# EAGLE design 1DPong_FootController (EAGLE 6.5.0)
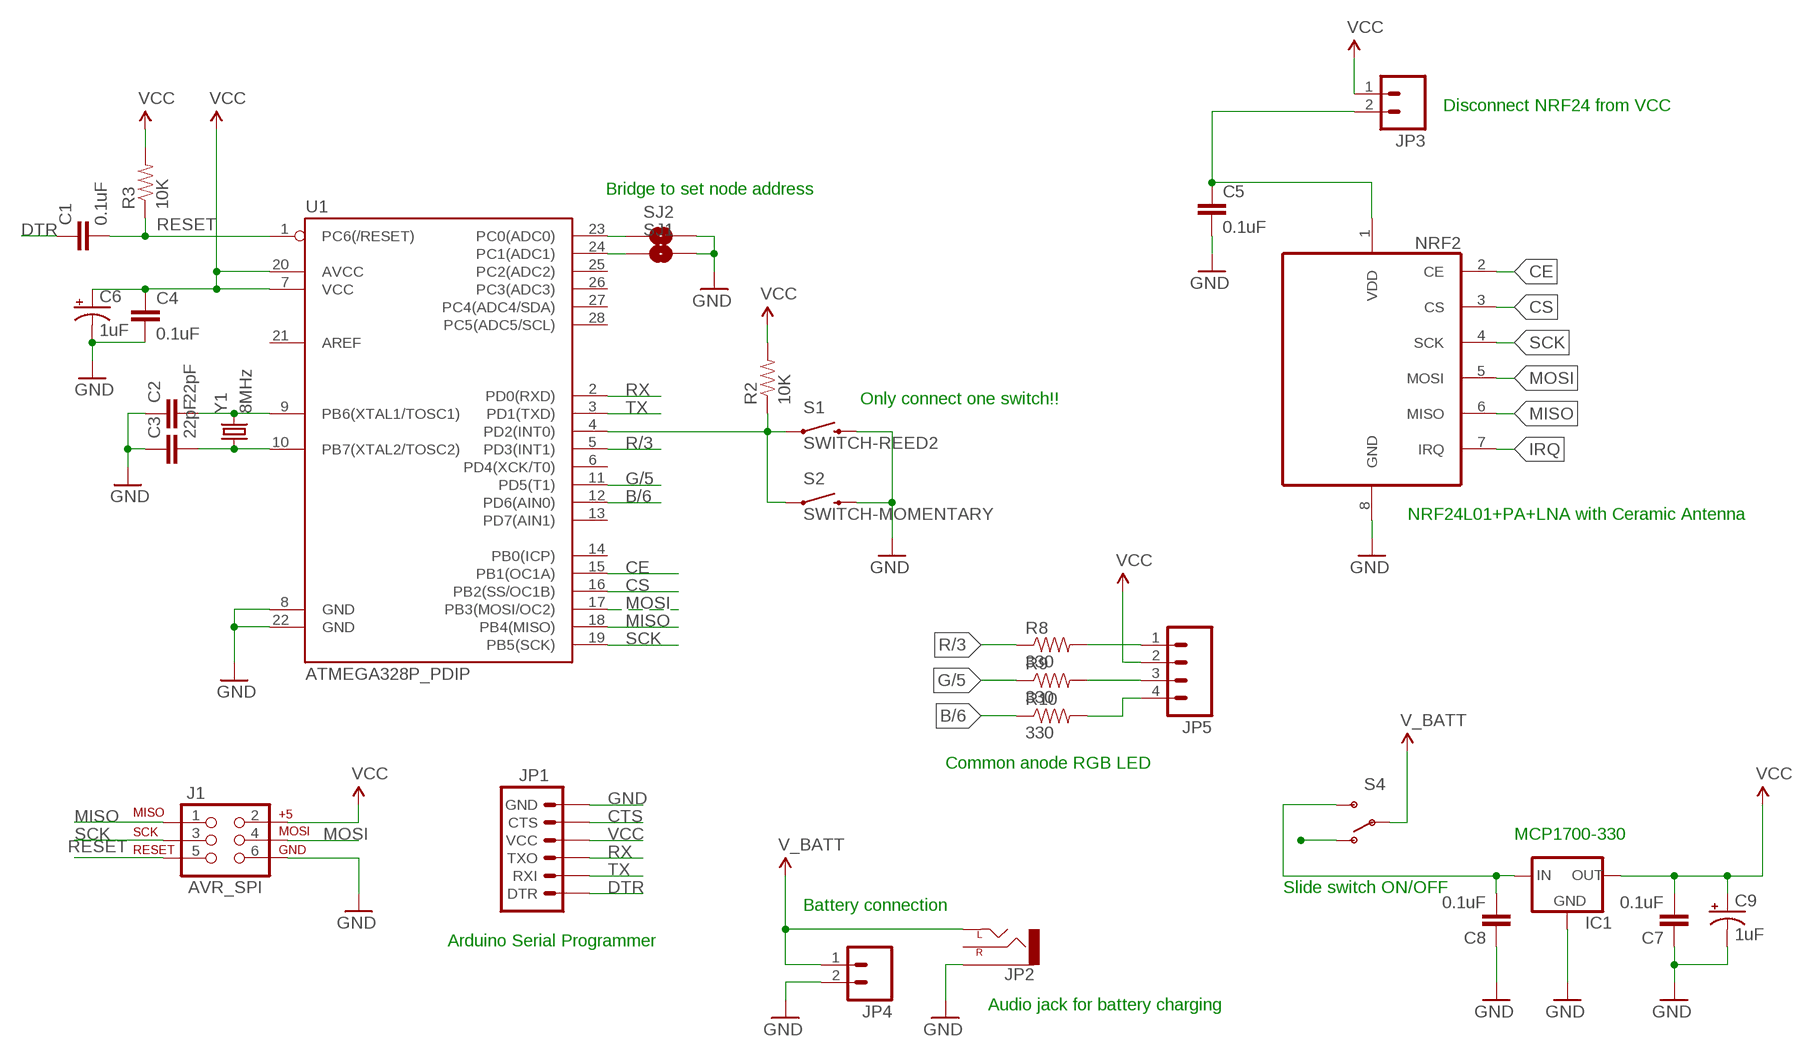
[diagram p0: schematic, sheet 1]

## Parts
C1  0.1uF  CAPPTH  [CAP-PTH-SMALL]
C2  22pF  CAPPTH  [CAP-PTH-SMALL]
C3  22pF  CAPPTH  [CAP-PTH-SMALL]
C4  0.1uF  CAPPTH  [CAP-PTH-SMALL]
C5  0.1uF  CAPPTH  [CAP-PTH-SMALL]
C6  1uF  CAP_POLPTH2  [CPOL-RADIAL-10UF-25V]
C7  0.1uF  CAPPTH  [CAP-PTH-SMALL]
C8  0.1uF  CAPPTH  [CAP-PTH-SMALL]
C9  1uF  CAP_POLPTH2  [CPOL-RADIAL-10UF-25V]
IC1  V_REG_78XXTO-92_UNTESTED  [TO-92]
J1  AVR_SPI  AVR_SPI_PRG_6PTH  [2X3]
JP1  ARDUINO_SERIAL_PROGRAMPTH  [1X06]
JP2  AUDIO-JACKPTH  [AUDIO-JACK]
JP3  M02PTH  [1X02]
JP4  M02PTH  [1X02]
JP5  M04PTH  [1X04]
NRF2  NRF24L01_SOIC  [NRF24L01_SOIC]
R2  10K  RESISTOR1206  [1206]
R3  10K  RESISTOR1206  [1206]
R8  330  RESISTOR1206  [1206]
R9  330  RESISTOR1206  [1206]
R10  330  RESISTOR1206  [1206]
S1  SWITCH-REED2  SWITCH-MOMENTARY-2PTH_REED2  [REED_SWITCH_PLASTIC]
S2  SWITCH-MOMENTARY  SWITCH-MOMENTARY-2PTH  [TACTILE-PTH]
S4  SWITCH-SPDT-SMD-A  [SWITCH-SPST-SMD-A]
SJ1  JUMPER-PAD-2-NOYES_SILK  [PAD-JUMPER-2-NO_YES_SILK]
SJ2  JUMPER-PAD-2-NOYES_SILK  [PAD-JUMPER-2-NO_YES_SILK]
U1  ATMEGA328P_PDIP  [DIL28-3]
Y1  8MHz  CRYSTALHC49US  [HC49US]

## Nets
B/6: R10.1 U1.12(PD6(AIN0))
CE: NRF2.2(CE) U1.15(PB1(OC1A))
CS: NRF2.3(CS) U1.16(PB2(SS/OC1B))
CTS: JP1.CTS
DTR: C1.1 JP1.DTR
G/5: R9.1 U1.11(PD5(T1))
GND: C2.1 C3.1 C4.2 C5.2 C6.2(-) C7.1 C8.1 C9.2(-) IC1.1(GND) J1.6 JP1.GND JP2.SLEEVE JP4.2 NRF2.8(GND) S1.P$2 S2.3 SJ1.2 SJ2.2 U1.8(GND) U1.22(GND)
IRQ: NRF2.7(IRQ)
MISO: J1.1 NRF2.6(MISO) U1.18(PB4(MISO))
MOSI: J1.4 NRF2.5(MOSI) U1.17(PB3(MOSI/OC2))
N$1: C2.2 U1.9(PB6(XTAL1/TOSC1)) Y1.2
N$2: C3.2 U1.10(PB7(XTAL2/TOSC2)) Y1.1
N$3: JP5.1 R8.2
N$5: SJ2.1 U1.23(PC0(ADC0))
N$6: SJ1.1 U1.24(PC1(ADC1))
N$7: JP5.3 R9.2
N$8: R2.1 S1.P$1 S2.1 U1.4(PD2(INT0))
N$10: C5.1 JP3.2 NRF2.1(VDD)
N$11: JP5.4 R10.2
N$12: S4.1(O)
N$16: C8.2 IC1.2(IN) S4.3(S)
R/3: R8.1 U1.5(PD3(INT1))
RESET: C1.2 J1.5 R3.1 U1.1(PC6(/RESET))
RX: JP1.TXO U1.2(PD0(RXD))
SCK: J1.3 NRF2.4(SCK) U1.19(PB5(SCK))
TX: JP1.RXI U1.3(PD1(TXD))
V_BATT: JP2.TIP(LEFT) JP4.1 S4.2(P)
VCC: C4.1 C6.1(+) C7.2 C9.1(+) IC1.3(OUT) J1.2 JP1.VCC JP3.1 JP5.2 R2.2 R3.2 U1.7(VCC) U1.20(AVCC)
Unconnected: JP2.RING(RIGHT) U1.6(PD4(XCK/T0)) U1.13(PD7(AIN1)) U1.14(PB0(ICP)) U1.21(AREF) U1.25(PC2(ADC2)) U1.26(PC3(ADC3)) U1.27(PC4(ADC4/SDA)) U1.28(PC5(ADC5/SCL))

## Notes on the sheet
- Disconnect NRF24 from VCC
- Bridge to set node address
- Only connect one switch!!
- NRF24L01+PA+LNA with Ceramic Antenna
- Common anode RGB LED
- MCP1700-330
- Slide switch ON/OFF
- Battery connection
- Arduino Serial Programmer
- Audio jack for battery charging

## Library data of the parts
C1-C5 C7 C8 = SparkFun-Capacitors:CAP: Capacitor Standard 0603 ceramic capacitor, and 0.1" leaded capacitor.
C6 C9 = SparkFun-Passives:CAP_POL: Capacitor Polarized These are standard SMD and PTH capacitors. Normally 10uF, 47uF, and 100uF in electrolytic and tantalum varieties. Always verify the external diameter of the through hole cap, it varies with capacity, voltage, and manufacturer. The EIA devices should be standard.
IC1 = SparkFun-PowerIC:V_REG_78XX: Voltage Regulator Standard 7805 5V regulator. IGO (Input Ground Output). Spark Fun Electronics SKU : COM-00107
J1 = SparkFun-Connectors:AVR_SPI_PRG_6: AVR ISP 6 Pin This is the reduced ISP connector for AVR programming. Common on Arduino. This footprint will take up less PCB space and can be used with a 10-pin to 6-pin adapter such as SKU: BOB-08508 **Special note about "TEST_POINT" package. The stop mask is on the top side, so if you want your programming test points to be on the bottom of your board, make sure to place this package on the bottom side of the board. This also ensure that the orientation to program from the bottom side will be correct.
JP1 = SparkFun-Connectors:ARDUINO_SERIAL_PROGRAM: FTDI connector footprints
JP2 = SparkFun-Connectors:AUDIO-JACK: 3.5mm Audio Jack Simple 3.5mm common PCB mount audio jack. SKU: PRT-08032
JP3 JP4 = SparkFun-Connectors:M02: Standard 2-pin 0.1" header. Use with - straight break away headers ( PRT-00116) - right angle break away headers (PRT-00553) - swiss pins (PRT-00743) - machine pins (PRT-00117) - female headers (PRT-00115) Molex polarized connector foot print use with: PRT-08233 with associated crimp pins and housings. 2.54_SCREWTERM for use with PRT-10571. 3.5mm Screw Terminal footprints for PRT-08084 5mm Screw Terminal footprints for use with PRT-08432
JP5 = SparkFun-Connectors:M04: Header 4 Standard 4-pin 0.1" header. Use with straight break away headers (SKU : PRT-00116), right angle break away headers (PRT-00553), swiss pins (PRT-00743), machine pins (PRT-00117), and female headers (PRT-00115). Molex polarized connector foot print use with SKU : PRT-08231 with associated crimp pins and housings. 1MM SMD Version SKU: PRT-10208
NRF2 = NRF24L01:NRF24L01_SOIC
R2 R3 R8-R10 = SparkFun-Resistors:RESISTOR: Resistor Basic schematic elements and footprints for 0603, 1206, and PTH resistors.
S1 S2 = SparkFun-Electromechanical:SWITCH-MOMENTARY-2: Various NO switches- pushbuttons, reed, etc
S4 = SparkFun-Electromechanical:SWITCH-SPDT: SPDT Switch Simple slide switch, Spark Fun Electronics SKU : COM-00102 DPDT SMT slide switch, AYZ0202, SWCH-08179
SJ1 SJ2 = SparkFun-Passives:JUMPER-PAD-2-NO
U1 = SparkFun-DigitalIC:ATMEGA328P_PDIP: uC used in the Arduino 32kb flash, 1k EEPROM, 2k SRAM This is the through-hole version of this chip.
Y1 = SparkFun-FreqCtrl:CRYSTAL: Various standard crystals. Proven footprints. Spark Fun Electronics SKU : COM-00534

## Board
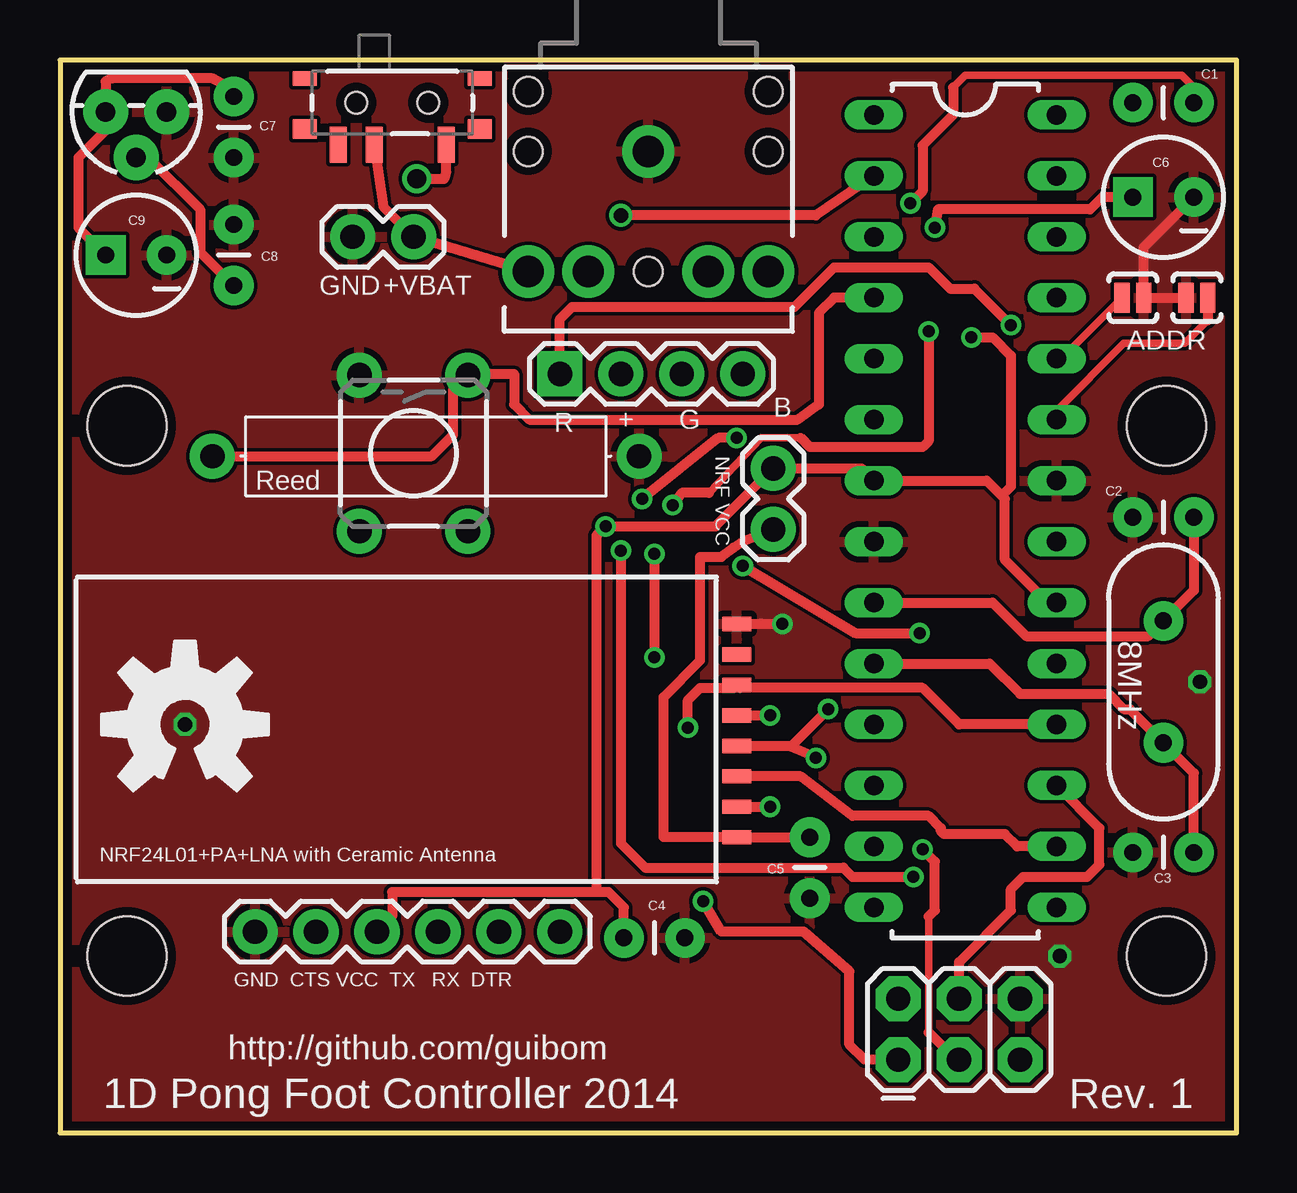
[diagram p1: board, top side]
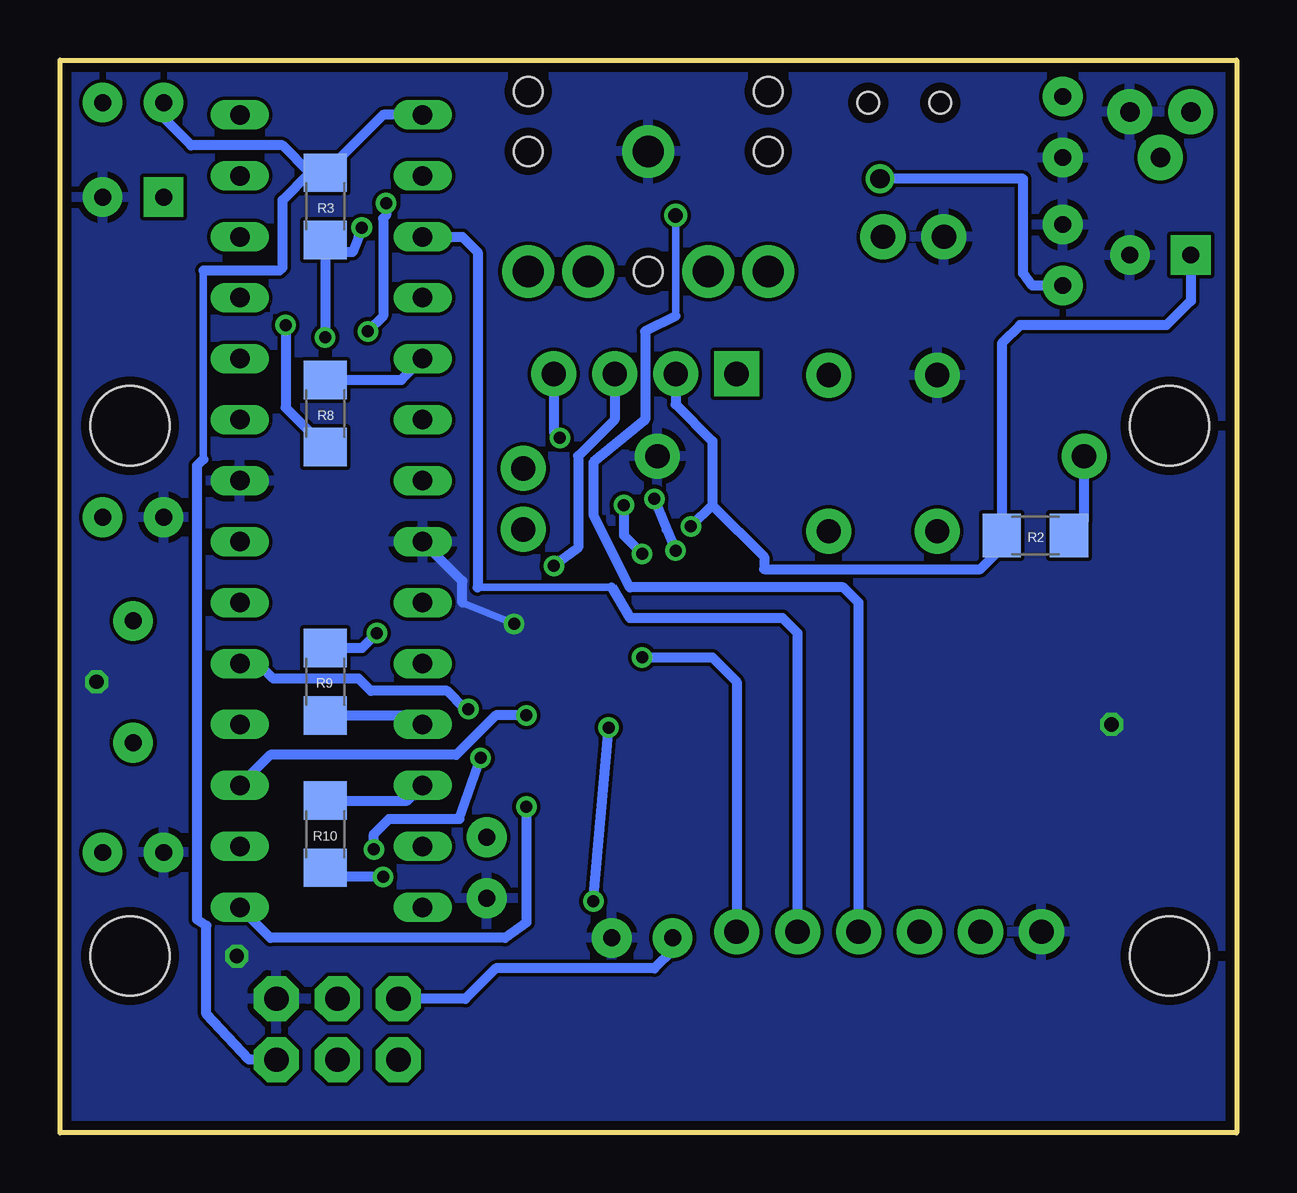
[diagram p2: board, bottom side, seen from below]

Size 49.02 x 44.7 mm. Coordinates in mm from the lower left corner, seen from the top.
Outline: 0,44.7 0,0 49.02,0 49.02,44.7 0,44.7
Copper layers (1*16): Top 0.0356mm / dielectric 1.5011mm / Bottom 0.0356mm
Design rules "LaenPCBOrder *": minimum track width 6mil, minimum drill 13mil, track to track 6mil, track to pad 6mil, pad to pad 6mil, via to via 6mil, smd to smd 6mil, copper to edge 15mil, drill to drill 6mil, minimum pad ring 7mil, minimum via ring 7mil, stop-mask expansion 3mil, vias tented up to drill 24mil, thermal gap 10mil

### Footprints (pad centres in the part's own frame; a part is rotated, then mirrored left to right if it is on the bottom)
CAP-PTH-SMALL = drill 0.7 pad 1.651: 1 0,0; 2 2.54,0
CPOL-RADIAL-10UF-25V = drill 0.7 pad 1.651 square: 1 1.27,0 | drill 0.7 pad 1.651: 2 -1.27,0
TO-92 = drill 0.813 pad 1.88: 1 -1.27,0; 2 0,1.905; 3 1.27,0
2X3 = drill 1.016 pad 1.88 octagon: 1 0,0; 2 0,2.54; 3 2.54,0; 4 2.54,2.54; 5 5.08,0; 6 5.08,2.54
1X06 = drill 1.016 pad 1.88: CTS 10.16,0; DTR 0,0; GND 12.7,0; RXI 2.54,0; TXO 5.08,0; VCC 7.62,0
AUDIO-JACK = drill 1.3 pad 2.184: RING 5,5; RSH 5,2.5; SLEEVE 0,0; TIP 5,-5; TSH 5,-2.5 | hole 1.2: 0,5; -2.5,5; -2.5,-5; 0,-5; 5,0
1X02 = drill 1.016 pad 1.88: 1 0,0; 2 2.54,0
1X04 = drill 1.016 pad 1.88 square: 1 0,0 | drill 1.016 pad 1.88: 2 2.54,0; 3 5.08,0; 4 7.62,0
NRF24L01_SOIC = smd 0.6 x 1.2: 1 -4.445,-2.8; 2 -3.175,-2.8; 3 -1.905,-2.8; 4 -0.635,-2.8; 5 0.635,-2.8; 6 1.905,-2.8; 7 3.175,-2.8; 8 4.445,-2.8
1206 = smd 1.6 x 1.8: 1 -1.4,0; 2 1.4,0
REED_SWITCH_PLASTIC = drill 1.016 pad 1.88: P$1 -8.89,0; P$2 8.89,0
TACTILE-PTH = drill 1.016 pad 1.88: 1 -3.251,2.261; 2 3.251,2.261; 3 -3.251,-2.261; 4 3.251,-2.261
SWITCH-SPST-SMD-A = smd 0.7 x 1.5: 1 -2.25,-1.75; 2 -0.75,-1.75; 3 2.25,-1.75 | smd 1 x 0.6: GND1 -3.65,1; GND3 3.65,1 | smd 1 x 0.8: GND2 -3.65,-1.1; GND4 3.65,-1.1 | hole 0.9: -1.5,0; 1.5,0
PAD-JUMPER-2-NO_YES_SILK = smd 0.635 x 1.27: 1 -0.45,0; 2 0.45,0
DIL28-3 = drill 0.813 long: 1 -16.51,-3.81; 2 -13.97,-3.81; 3 -11.43,-3.81; 4 -8.89,-3.81; 5 -6.35,-3.81; 6 -3.81,-3.81; 7 -1.27,-3.81; 8 1.27,-3.81; 9 3.81,-3.81; 10 6.35,-3.81; 11 8.89,-3.81; 12 11.43,-3.81; 13 13.97,-3.81; 14 16.51,-3.81; 15 16.51,3.81; 16 13.97,3.81; 17 11.43,3.81; 18 8.89,3.81; 19 6.35,3.81; 20 3.81,3.81; 21 1.27,3.81; 22 -1.27,3.81; 23 -3.81,3.81; 24 -6.35,3.81; 25 -8.89,3.81; 26 -11.43,3.81; 27 -13.97,3.81; 28 -16.51,3.81
STAND-OFF = hole 3.302: 0,0
HC49US = drill 0.7 pad 1.651: 1 -2.54,0; 2 2.54,0

### Placement (x,y rotation side)
C1  47.24,42.93 180 top
C2  44.7,25.65 0 top
C3  44.7,11.68 0 top
C4  23.5,8.13 0 top
C5  31.24,12.32 270 top
C6  45.97,38.99 180 top
C7  7.24,40.64 90 top
C8  7.24,37.85 270 top
C9  3.17,36.58 180 top
IC1  3.17,42.54 180 top
J1  34.92,3.05 0 top
JP1  20.83,8.38 180 top
JP2  24.51,40.89 270 top
JP3  29.72,27.69 270 top
JP4  14.73,37.34 180 top
JP5  20.83,31.62 0 top
NRF2  25.4,16.76 90 top
R2  8.38,24.89 180 bottom
R3  37.97,38.61 270 bottom
R8  37.97,29.97 270 bottom
R9  37.97,18.8 90 bottom
R10  37.97,12.45 270 bottom
S1  15.24,28.19 0 top
S2  14.73,28.32 270 top
S4  13.84,42.93 0 top
SJ1  44.7,34.8 0 top
SJ2  47.37,34.8 180 top
U1  37.72,25.91 270 top
U$1  [STAND-OFF]  2.79,7.37 0 top
U$2  [STAND-OFF]  46.1,7.37 0 top
U$3  [STAND-OFF]  2.79,29.46 0 top
U$4  [STAND-OFF]  46.1,29.46 0 top
U$5  [OSHW-LOGO-L]  5.21,17.02 0 top
Y1  45.97,18.8 90 top

### Tracks (layer width: path | path; a pad name or v marks a point on that pad's centre or on a via)
B/6
  Bottom 0.406: R10.1 34.54,13.84 U1.12
CE  (via drill 0.5)
  Top 0.406: NRF2.2 v29.59,13.59
  Bottom 0.406: v29.59,13.59 29.59,8.76 30.48,8.13 40.26,8.13 U1.15
CS
  Top 0.406: U1.16 39.88,11.94 39.37,12.45 36.83,12.45 36.7,12.57 36.7,12.7 36.2,13.21 33.02,13.21 30.86,14.86 NRF2.3
DTR  (via drill 0.5)
  Top 0.305: 47.24,43.56 46.74,44.07 37.72,44.07 37.21,43.56 | 30.86,28.96 29.21,28.96 27.05,26.67
  Top 0.406: C1.1 47.24,43.56 | 37.21,43.56 37.21,42.42 35.94,41.15 35.94,39.24 v35.43,38.73 | v36.2,33.4 36.2,28.83 35.94,28.58 31.24,28.58 30.86,28.96 | 27.05,26.67 25.91,26.67 v25.53,26.16 | v24.77,24.13 v24.77,19.81
  Bottom 0.406: v35.43,38.73 35.43,38.23 35.56,38.1 35.56,34.04 v36.2,33.4 | v25.53,26.16 25.53,24.89 v24.77,24.13 | v24.77,19.81 21.84,19.81 20.83,18.8 JP1.DTR
G/5
  Bottom 0.406: R9.1 34.29,17.4 U1.11
GND  (via drill 0.5, 0.6)
  Top 0.406: SJ2.2 SJ1.2 45.15,36.9 C6.2 | NRF2.8 29.22,21.21 v30.1,21.21
  Bottom 0.305: v30.1,21.21 32.26,22.1
  Bottom 0.406: 32.26,22.1 32.26,22.99 U1.8
  other vias: 5.21,17.02 41.66,7.37 47.5,18.8
  pour Top: -1.4,45.59 -1.4,-1.4 50.67,-1.4 50.67,45.59
  pour Bottom: -1.4,45.59 -1.4,-1.4 50.67,-1.4 50.67,45.59
MISO  (via drill 0.5)
  Top 0.406: U1.18 37.46,17.02 35.94,18.54 28.33,18.54 NRF2.6 28.07,18.54 26.67,18.54 26.16,18.03 v26.16,16.89 | J1.1 33.53,3.05 32.89,3.68 32.89,6.73 30.99,8.38 27.56,8.38 v26.8,9.65
  Bottom 0.406: v26.8,9.65 v26.16,16.89
MOSI  (via drill 0.5)
  Top 0.406: NRF2.5 v29.59,17.4 | J1.4 37.46,7.11 39.62,9.27 39.62,10.16 40.13,10.67 42.8,10.67 43.31,11.18 43.31,12.7 U1.17
  Bottom 0.406: v29.59,17.4 30.86,17.4 32.51,15.75 40.26,15.75 U1.17
N$1
  Top 0.406: C2.2 47.24,22.61 Y1.2 45.34,20.7 40.26,20.7 38.86,22.1 U1.9
N$2
  Top 0.406: C3.2 47.24,14.99 Y1.1 44.58,17.65 44.32,17.65 43.69,18.29 40,18.29 38.73,19.56 U1.10
N$3  (via drill 0.5)
  Top 0.406: JP5.1 20.83,33.91 21.34,34.42 30.61,34.42 32.26,36.07 36.2,36.07 37.08,35.18 38.1,35.18 v39.62,33.65
  Bottom 0.406: v39.62,33.65 39.62,30.22 R8.2
N$5
  Top 0.305: 47.82,33.85 46.86,32.89 44.32,32.89 41.53,30.1
  Top 0.406: SJ2.1 47.82,33.85 | U1.23 41.53,30.1
N$6
  Top 0.305: SJ1.1 41.71,32.26
  Top 0.406: 41.71,32.26 U1.24
N$7  (via drill 0.5)
  Top 0.406: v28.45,23.62 33.15,20.83 v35.81,20.83
  Bottom 0.406: JP5.3 25.91,29.72 27.43,28.19 27.43,24.38 v28.45,23.62 | v35.81,20.83 36.45,20.2 R9.2
N$8
  Top 0.406: S1.P$1 15.49,28.19 16.38,29.08 16.38,30.96 S2.1 17.04,31.62 18.92,31.62 18.92,30.35 19.56,29.72 30.73,29.72 31.62,30.35 31.62,34.16 32.26,34.8 U1.4
  Bottom 0.406: R2.1 6.35,25.52 S1.P$1
N$10
  Top 0.406: JP3.2 28.45,24.64 28.07,24.38 27.56,24 26.67,24 26.67,19.69 25.15,18.16 25.15,12.32 NRF2.1 C5.1
N$11  (via drill 0.5)
  Top 0.406: v28.19,28.96 27.43,28.96 v24.26,26.42 | v23.37,24.26 23.37,12.06 24.38,11.05 32.64,11.05 33.02,10.67 v35.56,10.67
  Bottom 0.406: JP5.4 28.45,29.21 v28.19,28.96 | v24.26,26.42 23.75,25.15 v23.37,24.26 | v35.56,10.67 37.59,10.67 R10.2
N$16  (via drill 0.8)
  Top 0.406: IC1.2 3.68,40.64 5.84,38.48 5.84,36.7 C8.2 | v14.86,39.75 16,39.75 16.09,40.1 S4.3
  Bottom 0.406: C8.2 8.51,35.31 8.89,35.81 8.89,39.75 v14.86,39.75
R/3
  Bottom 0.406: R8.1 34.79,31.37 U1.5
RESET
  Bottom 0.305: 43.05,28.07 43.05,35.94
  Bottom 0.406: U1.1 35.56,42.42 R3.1 38.61,40.01 | 38.61,40.01 39.75,41.15 43.56,41.15 44.7,42.29 C1.2 | J1.5 41.15,3.05 42.93,4.95 42.93,8.64 43.31,8.89 43.31,27.81 43.05,28.07 | 43.05,35.94 39.88,35.94 39.75,36.07 39.75,38.87 38.61,40.01
RX  (via drill 0.6)
  Top 0.406: U1.2 31.5,38.23 v23.37,38.23
  Bottom 0.305: v23.37,38.23 23.37,34.04
  Bottom 0.406: 23.37,34.04 24.64,33.4 24.64,29.72 26.8,27.94 26.8,25.78 25.27,22.73 16.38,22.73 15.75,22.1 JP1.TXO
SCK  (via drill 0.5)
  Top 0.305: 36.2,4.19 36.2,9.02
  Top 0.406: NRF2.4 30.35,16.13 | 30.35,16.13 30.48,16.13 v32,17.65 | J1.3 37.34,3.05 36.2,4.19 | 36.2,9.02 36.45,9.27 36.45,11.3 v35.94,11.81 | v31.5,15.62 31.24,15.75 30.35,16.13
  Bottom 0.406: v32,17.65 32.13,17.65 32.89,18.42 36.07,18.42 36.58,18.92 40.13,18.92 40.77,19.56 U1.19 | v35.94,11.81 35.94,12.45 35.31,13.08 32.38,13.08 v31.5,15.62
TX
  Bottom 0.305: 31.62,22.73 26.04,22.73
  Bottom 0.406: U1.3 32.26,37.34 31.62,36.7 31.62,22.73 | 26.04,22.73 25.27,21.46 18.92,21.46 18.29,20.83 JP1.RXI
V_BATT
  Top 0.406: JP2.TIP JP4.1 13.47,38.6 S4.2
VCC  (via drill 0.5)
  Top 0.406: U1.20 41.15,22.1 39.37,23.88 39.37,26.42 39.24,26.54 | 39.24,26.54 38.61,27.18 U1.7 33.4,27.69 JP3.1 27.3,25.27 v22.73,25.27 22.35,24.89 22.35,10.03 | C6.1 43.43,38.99 42.93,38.48 36.58,38.48 v36.45,37.72 | v37.97,33.15 38.86,33.15 39.62,32.38 39.62,26.92 39.24,26.54 | C4.1 23.5,9.4 22.86,10.03 22.35,10.03 | 22.35,10.03 13.84,10.03 13.84,9.02 JP1.VCC | C7.2 7.24,43.43 6.35,43.94 2.16,43.94 1.91,43.81 IC1.3 1.91,41.78 0.76,40.64 0.76,37.72 C9.1
  Bottom 0.406: JP5.2 23.37,30.35 21.84,28.83 21.84,26.16 | 21.84,26.16 v22.73,25.27 | v36.45,37.72 36.58,37.34 36.83,36.7 37.47,36.7 R3.2 v37.97,33.15 | C4.1 23.5,7.62 24.26,6.86 30.86,6.86 32.13,5.59 J1.2 | C9.1 1.91,34.67 2.92,33.65 9.02,33.65 9.78,32.89 R2.2 9.78,24.38 10.67,23.5 19.69,23.5 19.69,24 21.84,26.16

### Text on the board
tPlace: GND | +VBAT | ADDR | B | R | + | G | NRF VCC | Reed | 8MHz | NRF24L01+PA+LNA with Ceramic Antenna | GND CTS VCC TX RX DTR | http://github.com/guibom | 1D Pong Foot Controller 2014 | Rev. 1